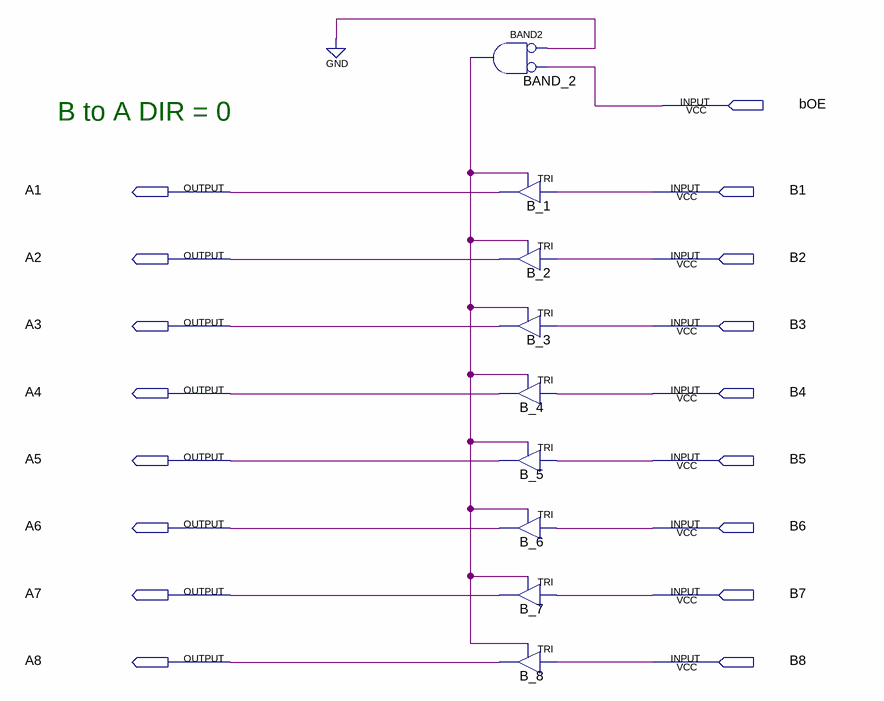
[diagram p0: schematic sheet]
// Quartus schematic IC_74LS245BA_RTL.bdf as structural Verilog: 9 symbols, 17 pins
module IC_74LS245BA_RTL (
  input  bOE,
  input  B1,
  input  B2,
  input  B3,
  input  B4,
  input  B5,
  input  B6,
  input  B7,
  input  B8,
  output A1,
  output A2,
  output A3,
  output A4,
  output A5,
  output A6,
  output A7,
  output A8
);

  wire BAND_2_out;

  and BAND_2 (BAND_2_out, ~1'b0, ~bOE);  // BAND2
  TRI B_1 (.IN(B1), .OE(BAND_2_out), .OUT(A1));
  TRI B_2 (.IN(B2), .OE(BAND_2_out), .OUT(A2));
  TRI B_3 (.IN(B3), .OE(BAND_2_out), .OUT(A3));
  TRI B_4 (.IN(B4), .OE(BAND_2_out), .OUT(A4));
  TRI B_5 (.IN(B5), .OE(BAND_2_out), .OUT(A5));
  TRI B_6 (.IN(B6), .OE(BAND_2_out), .OUT(A6));
  TRI B_7 (.IN(B7), .OE(BAND_2_out), .OUT(A7));
  TRI B_8 (.IN(B8), .OE(BAND_2_out), .OUT(A8));

  // Notes on the sheet:
  //   B to A DIR = 0
endmodule
